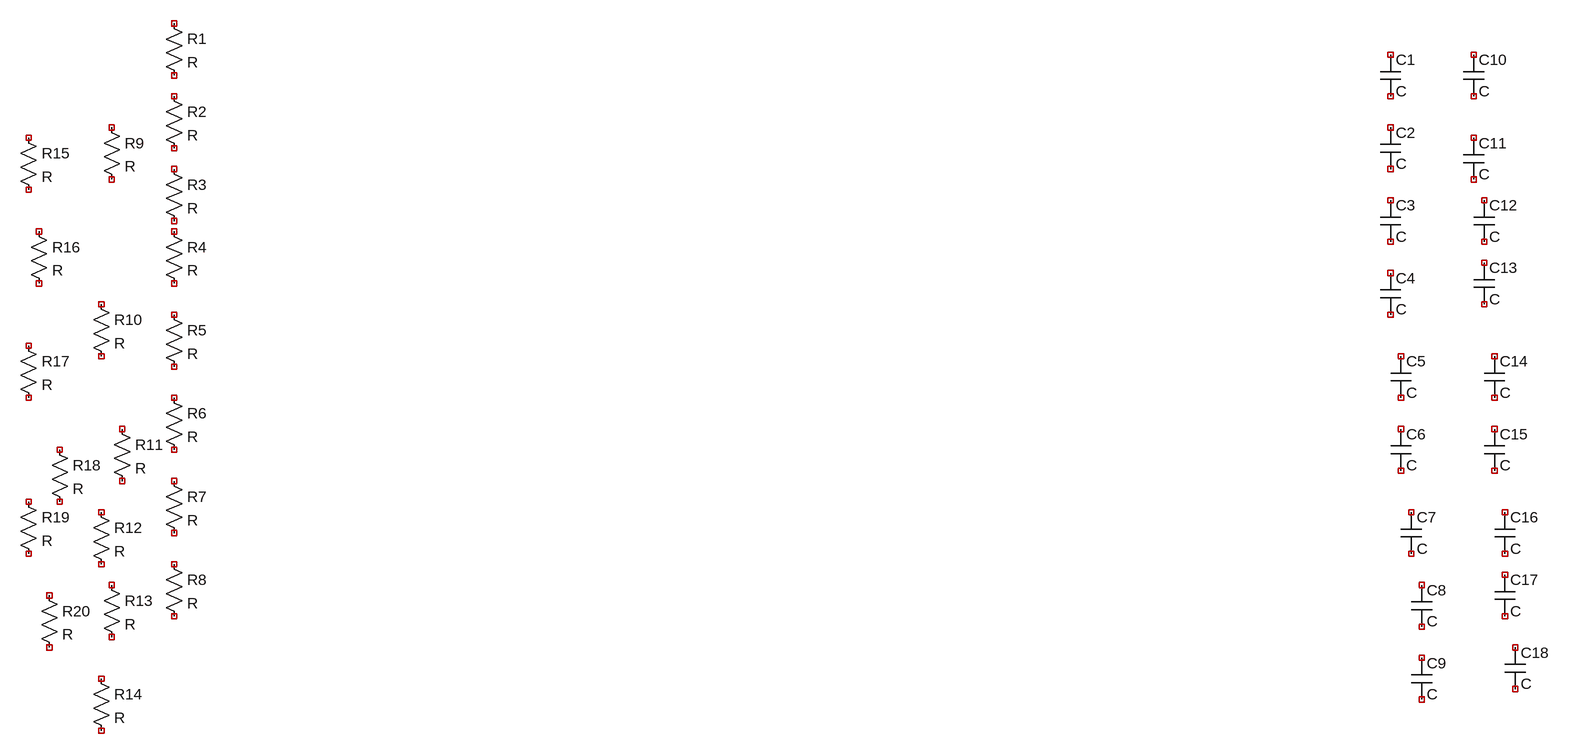
[diagram p0: schematic Draft1.asc]
Draft1.asc, the LTspice schematic file:
Version 4.1
SHEET 1 1448 776
SYMBOL res -688 -336 R0
SYMATTR InstName R1
SYMBOL res -688 -224 R0
SYMATTR InstName R2
SYMBOL res -688 -112 R0
SYMATTR InstName R3
SYMBOL res -688 -16 R0
SYMATTR InstName R4
SYMBOL res -688 112 R0
SYMATTR InstName R5
SYMBOL res -688 240 R0
SYMATTR InstName R6
SYMBOL res -688 368 R0
SYMATTR InstName R7
SYMBOL res -688 496 R0
SYMATTR InstName R8
SYMBOL res -784 -176 R0
SYMATTR InstName R9
SYMBOL res -800 96 R0
SYMATTR InstName R10
SYMBOL res -768 288 R0
SYMATTR InstName R11
SYMBOL res -800 416 R0
SYMATTR InstName R12
SYMBOL res -784 528 R0
SYMATTR InstName R13
SYMBOL res -800 672 R0
SYMATTR InstName R14
SYMBOL res -912 -160 R0
SYMATTR InstName R15
SYMBOL res -896 -16 R0
SYMATTR InstName R16
SYMBOL res -912 160 R0
SYMATTR InstName R17
SYMBOL res -864 320 R0
SYMATTR InstName R18
SYMBOL res -912 400 R0
SYMATTR InstName R19
SYMBOL res -880 544 R0
SYMATTR InstName R20
SYMBOL cap 1184 -272 R0
SYMATTR InstName C1
SYMBOL cap 1184 -160 R0
SYMATTR InstName C2
SYMBOL cap 1184 -48 R0
SYMATTR InstName C3
SYMBOL cap 1184 64 R0
SYMATTR InstName C4
SYMBOL cap 1200 192 R0
SYMATTR InstName C5
SYMBOL cap 1200 304 R0
SYMATTR InstName C6
SYMBOL cap 1216 432 R0
SYMATTR InstName C7
SYMBOL cap 1232 544 R0
SYMATTR InstName C8
SYMBOL cap 1232 656 R0
SYMATTR InstName C9
SYMBOL cap 1312 -272 R0
SYMATTR InstName C10
SYMBOL cap 1312 -144 R0
SYMATTR InstName C11
SYMBOL cap 1328 -48 R0
SYMATTR InstName C12
SYMBOL cap 1328 48 R0
SYMATTR InstName C13
SYMBOL cap 1344 192 R0
SYMATTR InstName C14
SYMBOL cap 1344 304 R0
SYMATTR InstName C15
SYMBOL cap 1360 432 R0
SYMATTR InstName C16
SYMBOL cap 1360 528 R0
SYMATTR InstName C17
SYMBOL cap 1376 640 R0
SYMATTR InstName C18

The netlist it stands for:
* Draft1.asc
R1 NC_01 NC_02 R
R2 NC_03 NC_04 R
R3 NC_05 NC_06 R
R4 NC_07 NC_08 R
R5 NC_09 NC_10 R
R6 NC_11 NC_12 R
R7 NC_13 NC_14 R
R8 NC_15 NC_16 R
R9 NC_17 NC_18 R
R10 NC_19 NC_20 R
R11 NC_21 NC_22 R
R12 NC_23 NC_24 R
R13 NC_25 NC_26 R
R14 NC_27 NC_28 R
R15 NC_29 NC_30 R
R16 NC_31 NC_32 R
R17 NC_33 NC_34 R
R18 NC_35 NC_36 R
R19 NC_37 NC_38 R
R20 NC_39 NC_40 R
C1 NC_41 NC_42 C
C2 NC_43 NC_44 C
C3 NC_45 NC_46 C
C4 NC_47 NC_48 C
C5 NC_49 NC_50 C
C6 NC_51 NC_52 C
C7 NC_53 NC_54 C
C8 NC_55 NC_56 C
C9 NC_57 NC_58 C
C10 NC_59 NC_60 C
C11 NC_61 NC_62 C
C12 NC_63 NC_64 C
C13 NC_65 NC_66 C
C14 NC_67 NC_68 C
C15 NC_69 NC_70 C
C16 NC_71 NC_72 C
C17 NC_73 NC_74 C
C18 NC_75 NC_76 C
.backanno
.end